# Altium schematic sheet AUAV-X1_FMU_R1.SchDoc: PX4HAWK_CLONE
size A4; DrawnBy: Nick Arsov; Revision: 1; SheetNumber: 1; SheetTotal: 11; PageSetup: Record=PageOptions|CenterHorizontal=True|CenterVertical=True|PrintScale=0.97|XCorrection=1.00|YCorrection=1.00|PrintKind=2|BorderSize=5000000|LeftOffset=0|BottomOffset=0|Orientation=2|PaperLength=1000|PaperWidth=1000|Scale=100|PaperSource=267|PrintQuality=-4|MediaType=1|DitherType=1|PaperKind=A4|PrintScaleMode=1; DocumentName: PX4HAWK_CLONE
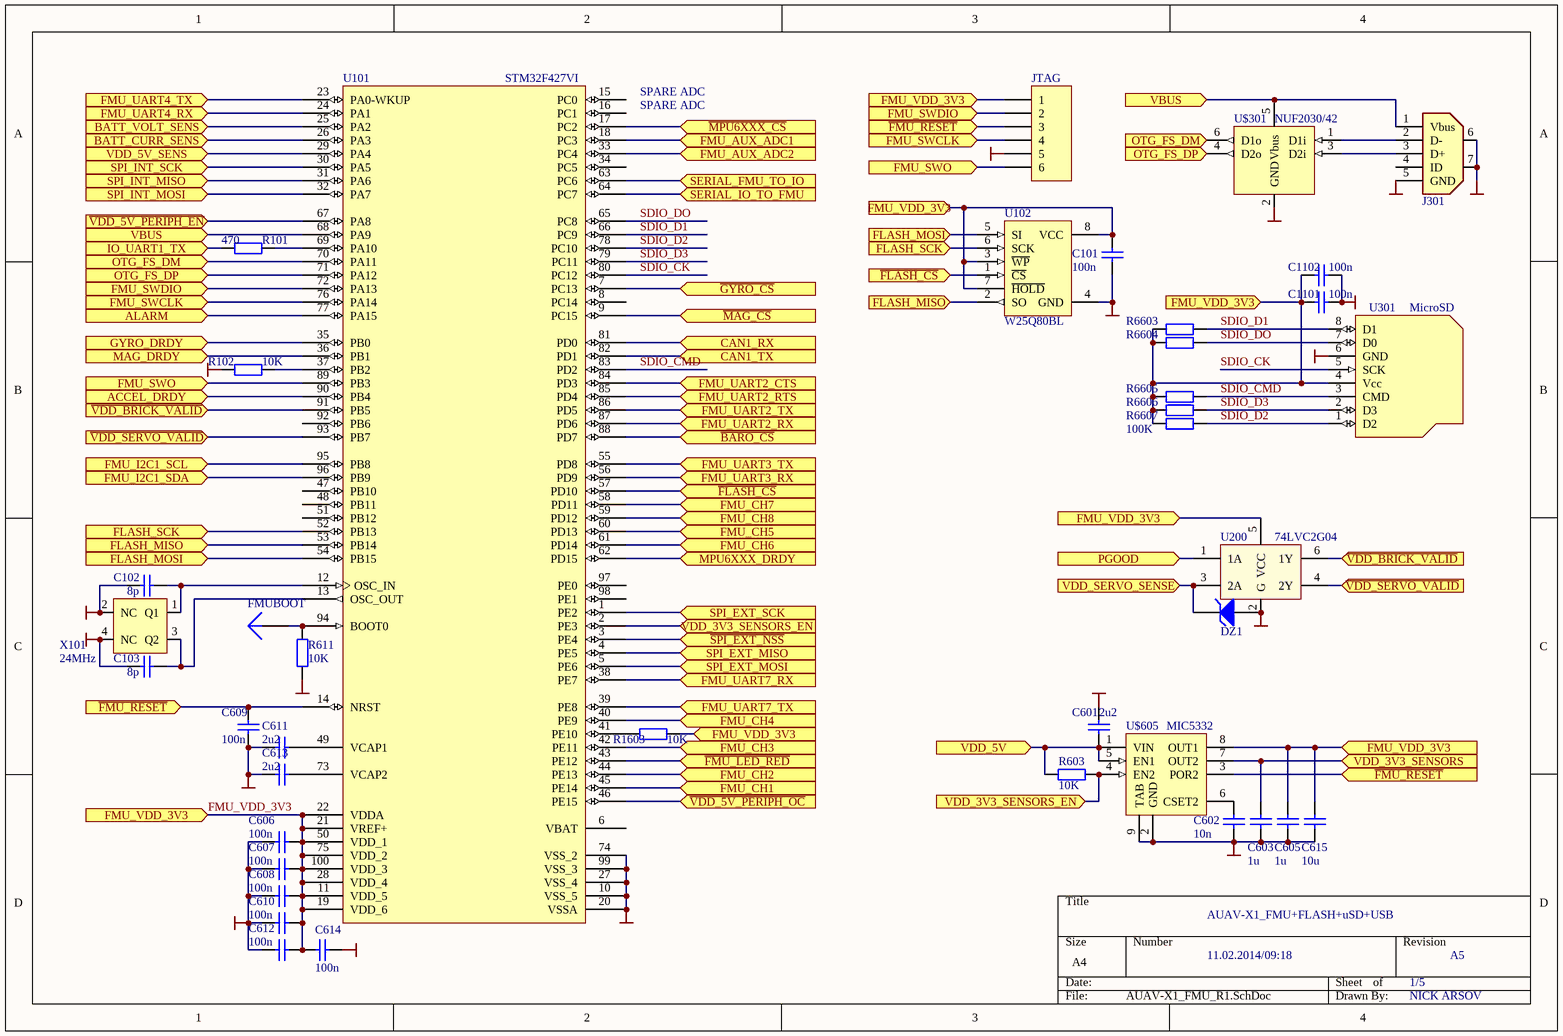
[diagram p0: AUAV-X1_FMU_R1.SchDoc]

## Parts
C101  100n  [0402A]
C102  8p  [0402A]
C103  8p  [0402A]
C601  2u2  [0402A]
C602  10n  [0402A]
C603  1u  [0402A]
C605  1u  [0402A]
C606  100n  [0402A]
C607  100n  [0402A]
C608  100n  [0402A]
C609  100n  [0402A]
C610  100n  [0402A]
C611  2u2  [0402A]
C612  100n  [0402A]
C613  2u2  [0402A]
C614  100n  [0402A]
C615  10u  [0402A]
C1101  100n  [0402A]
C1102  100n  [0402A]
DZ1  D Zener  [SOD-523]  (value not drawn)
FMUBOOT  Plug  [PAD1]  (value not drawn)
J301  miniUSB  [USBmicro_B]  (value not drawn)
JTAG  Header 6  [JTAG_TC2030]  (value not drawn)
R101  470  [0402A]
R102  10K  [0402A]
R603  10K  [0402A]
R611  10K  [0402A]
R1603  10K  [0402A]
R6603  100K  [0402A]  (value not drawn)
R6604  100K  [0402A]  (value not drawn)
R6605  100K  [0402A]  (value not drawn)
R6606  100K  [0402A]  (value not drawn)
R6607  100K  [0402A]
U101  STM32F427VI  [LQFP100_L]
U102  W25Q80BL  [W25Q80BL_WSON5X6]
U200  74LVC2G04  [SOT363_L]
U301  MicroSD  [MicroSD_China_01]
U$301  NUF2030/42  [NUF2030_SOT563]
U$605  MIC5332  [MIC5332]
X101  24MHz  [Crystal_2.5x2]

## Ports
ACCEL_DRDY, ALARM, BATT_CURR_SENS, BATT_VOLT_SENS, CAN1_RX, CAN1_TX, FLASH_MISO, FLASH_MOSI, FLASH_SCK, FMU_AUX_ADC1, FMU_AUX_ADC2, FMU_CH1, FMU_CH2, FMU_CH3, FMU_CH4, FMU_CH5, FMU_CH6, FMU_CH7, FMU_CH8, FMU_I2C1_SCL, FMU_I2C1_SDA, FMU_SWCLK, FMU_SWDIO, FMU_SWO, FMU_UART2_CTS, FMU_UART2_RTS, FMU_UART2_RX, FMU_UART2_TX, FMU_UART3_RX, FMU_UART3_TX, FMU_UART4_RX, FMU_UART4_TX, FMU_UART7_RX, FMU_UART7_TX, FMU_VDD_3V3, GYRO_DRDY, IO_UART1_TX, MAG_DRDY, MPU6XXX_DRDY, OTG_FS_DM, OTG_FS_DP, PGOOD, SERIAL_FMU_TO_IO, SERIAL_IO_TO_FMU, SPI_EXT_MISO, SPI_EXT_MOSI, SPI_EXT_SCK, SPI_INT_MISO, SPI_INT_MOSI, SPI_INT_SCK, VBUS, VDD_3V3_SENSORS, VDD_3V3_SENSORS_EN, VDD_5V, VDD_5V_SENS, VDD_SERVO_SENSE, ~{BARO_CS}, ~{FLASH_CS}, ~{FMU_LED_RED}, ~{FMU_RESET}, ~{GYRO_CS}, ~{MAG_CS}, ~{MPU6XXX_CS}, ~{SPI_EXT_NSS}, ~{VDD_5V_PERIPH_EN}, ~{VDD_5V_PERIPH_OC}, ~{VDD_BRICK_VALID}, ~{VDD_SERVO_VALID}

## Nets
GND: C101.1 C102.1 C103.1 C601.2 C602.1 C603.1 C605.1 C606.1 C607.1 C608.1 C609.1 C610.1 C611.1 C612.1 C613.1 C614.1 C615.1 C1101.1 C1102.1 DZ1.2(K) J301.5(GND) J301.6(GND) J301.7(GND) JTAG.5 R102.1 R611.1 U101.10(VSS_5) U101.20(VSSA) U101.27(VSS_4) U101.74(VSS_2) U101.99(VSS_3) U102.4(GND) U200.2(G) U301.6(GND) U$301.2(GND) U$605.2(GND) U$605.9(TAB) X101.2(NC) X101.4(NC)
~{BARO_CS}: U101.88(PD7) ; port ~{BARO_CS}
~{FLASH_CS}: U101.57(PD10) U102.1(~{CS}) ; port ~{FLASH_CS}
~{FMU_LED_RED}: U101.43(PE12) ; port ~{FMU_LED_RED}
~{FMU_RESET}: C609.2 JTAG.3 U101.14(NRST) U$605.3(POR2) ; port ~{FMU_RESET}
~{GYRO_CS}: U101.7(PC13) ; port ~{GYRO_CS}
~{MAG_CS}: U101.9(PC15) ; port ~{MAG_CS}
~{MPU6XXX_CS}: U101.17(PC2) ; port ~{MPU6XXX_CS}
~{SPI_EXT_NSS}: U101.3(PE4) ; port ~{SPI_EXT_NSS}
~{VDD_5V_PERIPH_EN}: U101.67(PA8) ; port ~{VDD_5V_PERIPH_EN}
~{VDD_5V_PERIPH_OC}: U101.46(PE15) ; port ~{VDD_5V_PERIPH_OC}
~{VDD_BRICK_VALID}: U101.91(PB5) U200.6(1Y) ; port ~{VDD_BRICK_VALID}
~{VDD_SERVO_VALID}: U101.93(PB7) U200.4(2Y) ; port ~{VDD_SERVO_VALID}
ACCEL_DRDY: U101.90(PB4) ; port ACCEL_DRDY
ALARM: U101.77(PA15) ; port ALARM
BATT_CURR_SENS: U101.26(PA3) ; port BATT_CURR_SENS
BATT_VOLT_SENS: U101.25(PA2) ; port BATT_VOLT_SENS
CAN1_RX: U101.81(PD0) ; port CAN1_RX
CAN1_TX: U101.82(PD1) ; port CAN1_TX
FLASH_MISO: U101.53(PB14) U102.2(SO) ; port FLASH_MISO
FLASH_MOSI: U101.54(PB15) U102.5(SI) ; port FLASH_MOSI
FLASH_SCK: U101.52(PB13) U102.6(SCK) ; port FLASH_SCK
FMU_AUX_ADC1: U101.18(PC3) ; port FMU_AUX_ADC1
FMU_AUX_ADC2: U101.33(PC4) ; port FMU_AUX_ADC2
FMU_CH1: U101.45(PE14) ; port FMU_CH1
FMU_CH2: U101.44(PE13) ; port FMU_CH2
FMU_CH3: U101.42(PE11) ; port FMU_CH3
FMU_CH4: U101.40(PE9) ; port FMU_CH4
FMU_CH5: U101.60(PD13) ; port FMU_CH5
FMU_CH6: U101.61(PD14) ; port FMU_CH6
FMU_CH7: U101.58(PD11) ; port FMU_CH7
FMU_CH8: U101.59(PD12) ; port FMU_CH8
FMU_I2C1_SCL: U101.95(PB8) ; port FMU_I2C1_SCL
FMU_I2C1_SDA: U101.96(PB9) ; port FMU_I2C1_SDA
FMU_SWCLK: JTAG.4 U101.76(PA14) ; port FMU_SWCLK
FMU_SWDIO: JTAG.2 U101.72(PA13) ; port FMU_SWDIO
FMU_SWO: JTAG.6 U101.89(PB3) ; port FMU_SWO
FMU_UART2_CTS: U101.84(PD3) ; port FMU_UART2_CTS
FMU_UART2_RTS: U101.85(PD4) ; port FMU_UART2_RTS
FMU_UART2_RX: U101.87(PD6) ; port FMU_UART2_RX
FMU_UART2_TX: U101.86(PD5) ; port FMU_UART2_TX
FMU_UART3_RX: U101.56(PD9) ; port FMU_UART3_RX
FMU_UART3_TX: U101.55(PD8) ; port FMU_UART3_TX
FMU_UART4_RX: U101.24(PA1) ; port FMU_UART4_RX
FMU_UART4_TX: U101.23(PA0-WKUP) ; port FMU_UART4_TX
FMU_UART7_RX: U101.38(PE7) ; port FMU_UART7_RX
FMU_UART7_TX: U101.39(PE8) ; port FMU_UART7_TX
FMU_VDD_3V3: C101.2 C605.2 C606.2 C607.2 C608.2 C610.2 C612.2 C614.2 C615.2 C1101.2 C1102.2 JTAG.1 R1603.2 R6603.1 R6604.1 R6605.1 R6606.1 R6607.1 U101.11(VDD_5) U101.19(VDD_6) U101.21(VREF+) U101.22(VDDA) U101.28(VDD_4) U101.50(VDD_1) U101.75(VDD_2) U101.100(VDD_3) U102.3(~{WP}) U102.7(~{HOLD}) U102.8(VCC) U200.5(VCC) U301.4(Vcc) U$605.8(OUT1) ; port FMU_VDD_3V3
GYRO_DRDY: U101.35(PB0) ; port GYRO_DRDY
IO_UART1_TX: R101.1 ; port IO_UART1_TX
MAG_DRDY: U101.36(PB1) ; port MAG_DRDY
MPU6XXX_DRDY: U101.62(PD15) ; port MPU6XXX_DRDY
OTG_FS_DM: U101.70(PA11) U$301.6(D1o) ; port OTG_FS_DM
OTG_FS_DP: U101.71(PA12) U$301.4(D2o) ; port OTG_FS_DP
PGOOD: U200.1(1A) ; port PGOOD
SDIO_CK: U101.80(PC12) U301.5(SCK)
SDIO_CMD: R6605.2 U101.83(PD2) U301.3(CMD)
SDIO_D1: R6603.2 U101.66(PC9) U301.8(D1)
SDIO_D2: R6607.2 U101.78(PC10) U301.1(D2)
SDIO_D3: R6606.2 U101.79(PC11) U301.2(D3)
SDIO_DO: R6604.2 U101.65(PC8) U301.7(D0)
SERIAL_FMU_TO_IO: U101.63(PC6) ; port SERIAL_FMU_TO_IO
SERIAL_IO_TO_FMU: U101.64(PC7) ; port SERIAL_IO_TO_FMU
SPI_EXT_MISO: U101.4(PE5) ; port SPI_EXT_MISO
SPI_EXT_MOSI: U101.5(PE6) ; port SPI_EXT_MOSI
SPI_EXT_SCK: U101.1(PE2) ; port SPI_EXT_SCK
SPI_INT_MISO: U101.31(PA6) ; port SPI_INT_MISO
SPI_INT_MOSI: U101.32(PA7) ; port SPI_INT_MOSI
SPI_INT_SCK: U101.30(PA5) ; port SPI_INT_SCK
VBUS: J301.1(Vbus) U101.68(PA9) U$301.5(Vbus) ; port VBUS
VDD_3V3_SENSORS: C603.2 U$605.7(OUT2) ; port VDD_3V3_SENSORS
VDD_3V3_SENSORS_EN: R603.2 U101.2(PE3) U$605.4(EN2) ; port VDD_3V3_SENSORS_EN
VDD_5V: C601.1 R603.1 U$605.1(VIN) U$605.5(EN1) ; port VDD_5V
VDD_5V_SENS: U101.29(PA4) ; port VDD_5V_SENS
VDD_SERVO_SENSE: DZ1.1(A) U200.3(2A) ; port VDD_SERVO_SENSE
NetC102_2: C102.2 U101.12(OSC_IN) X101.1(Q1)
NetC103_2: C103.2 U101.13(OSC_OUT) X101.3(Q2)
NetC602_2: C602.2 U$605.6(CSET2)
NetC611_2: C611.2 U101.49(VCAP1)
NetC613_2: C613.2 U101.73(VCAP2)
NetFMUBOOT_1: FMUBOOT.1 R611.2 U101.94(BOOT0)
NetJ301_2: J301.2(D-) U$301.1(D1i)
NetJ301_3: J301.3(D+) U$301.3(D2i)
NetR101_2: R101.2 U101.69(PA10)
NetR102_2: R102.2 U101.37(PB2)
NetR1603_1: R1603.1 U101.41(PE10)

Not connected (* = marked no-connect by the designer): J301 4(ID); U101 6(VBAT) 8(PC14) 15(PC0) 16(PC1) 34(PC5) 47(PB10) 48(PB11) 51(PB12) 92(PB6) 97(PE0) 98(PE1)

## Notes on the sheet
- SPARE ADC
- AUAV-X1_FMU+FLASH+uSD+USB
- 11.02.2014/09:18
- 1/5
- A5
- NICK ARSOV

## Library data of the parts
C101-C103 C601-C603 C605-C615 C1101 C1102 = Cap: Capacitor; Value: 100pF; Published: 8-Jun-2000; LatestRevisionDate: 17-Jul-2002; LatestRevisionNote: Re-released for DXP Platform.; PackageReference: RAD-0.3; Publisher: Altium Limited
DZ1 = D Zener: Zener Diode; Published: 8-Jun-2000; LatestRevisionDate: 17-Jul-2002; LatestRevisionNote: Re-released for DXP Platform.; PackageReference: DIODE-0.7; Publisher: Altium Limited
J301 = MicroUSB
JTAG = Header 6: Header, 6-Pin; LatestRevisionDate: 17-Jul-2002; LatestRevisionNote: Re-released for DXP Platform.; Publisher: Altium Limited
R101 R102 R603 R611 R1603 R6603-R6607 = Res2: Resistor; Value: 1K; Published: 8-Jun-2000; LatestRevisionDate: 17-Jul-2002; LatestRevisionNote: Re-released for DXP Platform.; PackageReference: AXIAL-0.4; Publisher: Altium Limited
U101 = STM32F103VBT6: STM32 ARM-based 32-bit MCU with 64 Kbytes Flash, 100-pin LQFP, Industrial Temperature; Published: 30-May-2008; DatasheetVersion: rev6, Mar-2008; PackageVersion: Mar-2008; PackageReference: LQFP100; Publisher: Altium Limited; PackageDescription: 100-Pin Low-Profile Quad Flat Pack, 14 x 14 mm Body, 0.5 mm Pitch (LQFP100); ComponentLink1Description: Manufacturer Link; ComponentLink1URL: www.st.com/stm32; ComponentLink2Description: Datasheet; ComponentLink2URL: http://www.st.com/stonline/products/literature/ds/13587.pdf
U102 = AT45DB161D-MU
X101 = Crystal_4pin
FMUBOOT = Plug: LatestRevisionDate: 17-Jul-2002; LatestRevisionNote: Re-released for DXP Platform.; Publisher: Altium Limited